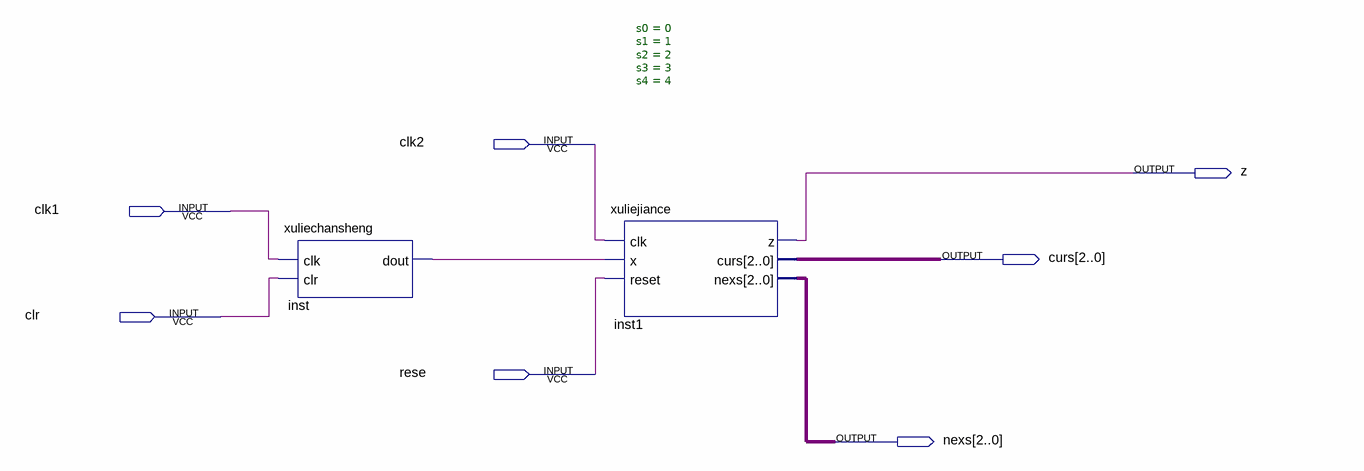
[diagram p0: schematic sheet]
// Quartus schematic g04_190711_09.bdf as structural Verilog: 2 symbols, 7 pins
module g04_190711_09 (
  input  clk2,
  input  clk1,
  input  clr,
  input  rese,
  output z,
  output [2:0] curs,
  output [2:0] nexs
);

  wire inst_dout;

  xuliechansheng inst (.clk(clk1), .clr(clr), .dout(inst_dout));
  xuliejiance #(.s0(0), .s1(1), .s2(2), .s3(3), .s4(4)) inst1 (
    .clk(clk2), .x(inst_dout), .reset(rese), .z(z), .curs(curs), .nexs(nexs));
endmodule
